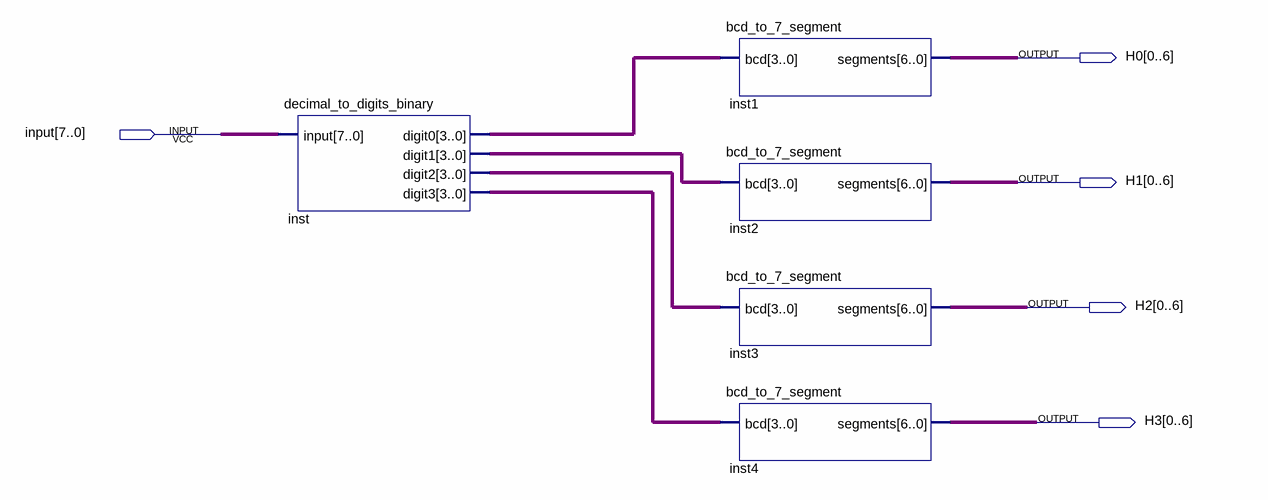
[diagram p0: schematic sheet]
// Quartus schematic dtdb_bdf.bdf as structural Verilog: 5 symbols, 5 pins
module dtdb_bdf (
  input  [7:0] \input ,
  output [0:6] H0,
  output [0:6] H1,
  output [0:6] H2,
  output [0:6] H3
);

  wire [3:0] inst_digit0, inst_digit1, inst_digit2, inst_digit3;

  decimal_to_digits_binary inst (
    .\input (\input ), .digit0(inst_digit0), .digit1(inst_digit1), .digit2(inst_digit2), .digit3(inst_digit3));
  bcd_to_7_segment inst1 (.bcd(inst_digit0), .segments(H0));
  bcd_to_7_segment inst2 (.bcd(inst_digit1), .segments(H1));
  bcd_to_7_segment inst3 (.bcd(inst_digit2), .segments(H2));
  bcd_to_7_segment inst4 (.bcd(inst_digit3), .segments(H3));
endmodule
